# Altium schematic sheet power.SchDoc
size A2; SheetNumber: 5; SheetTotal: 6
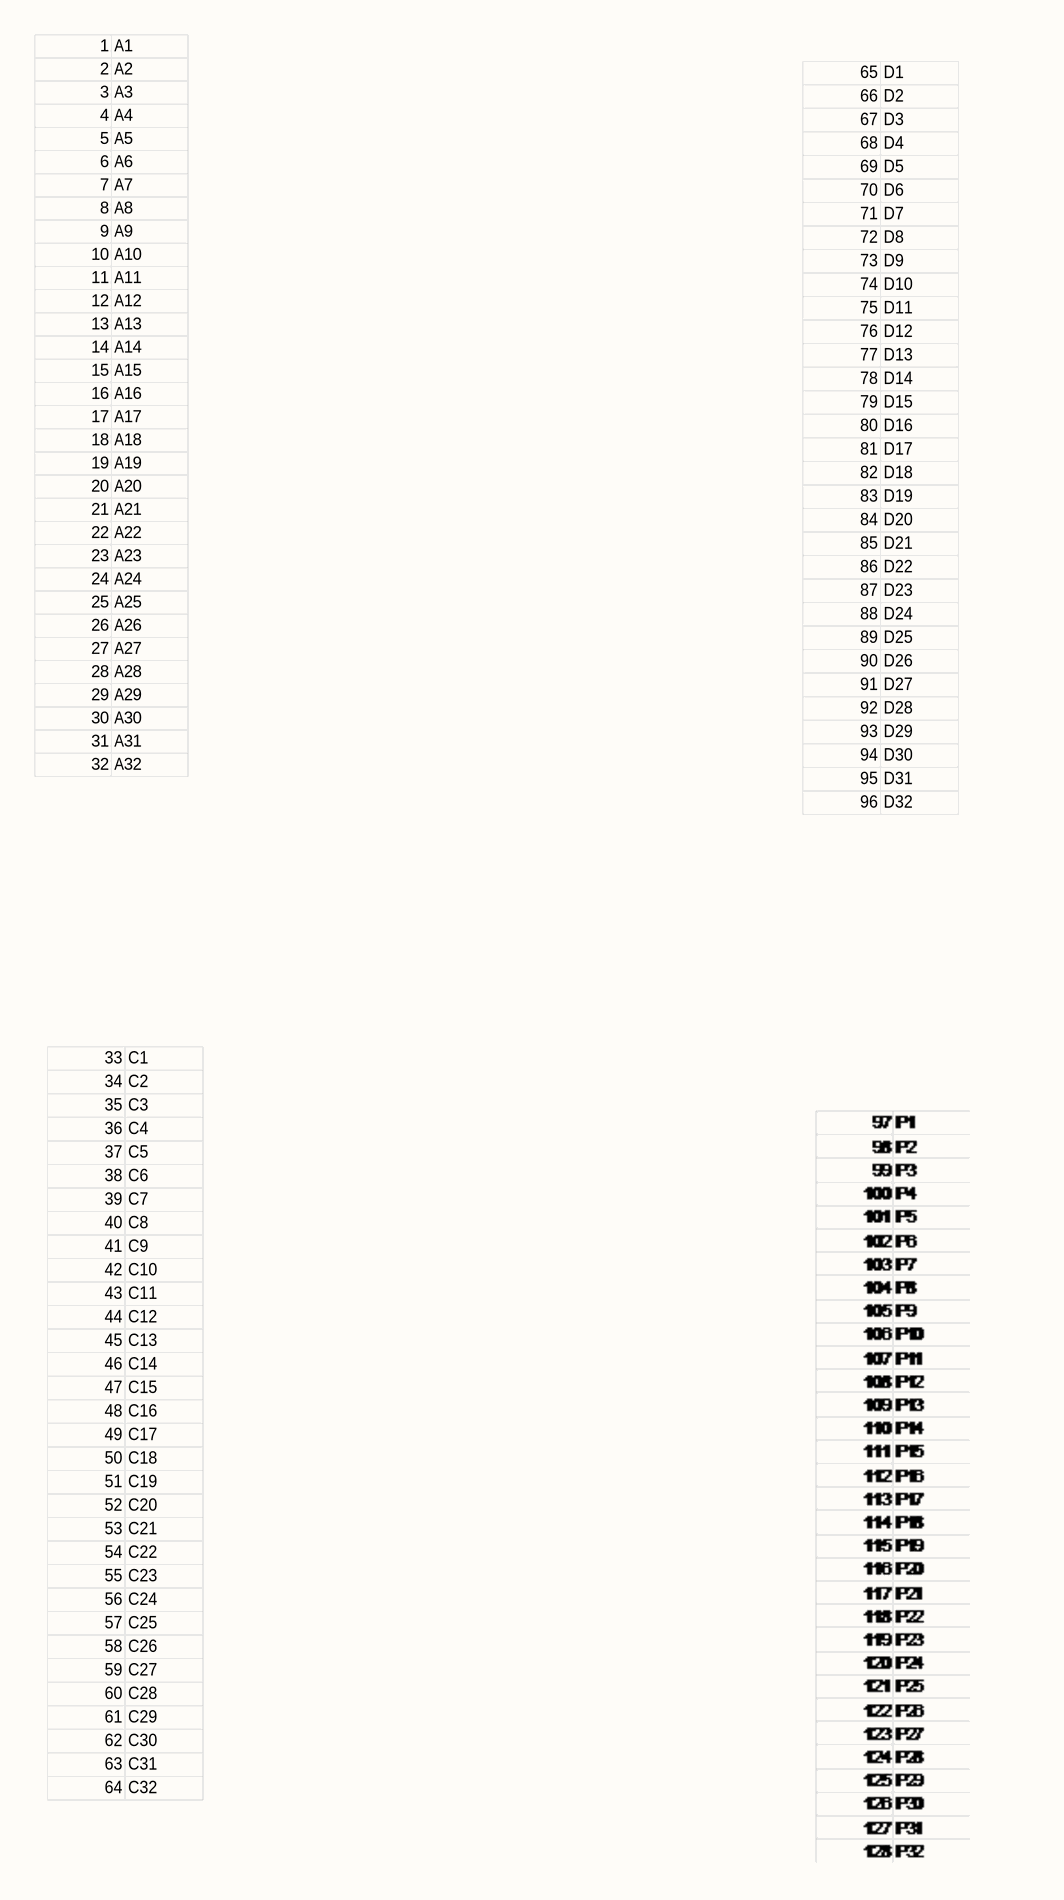
[diagram p0: power.SchDoc, left]
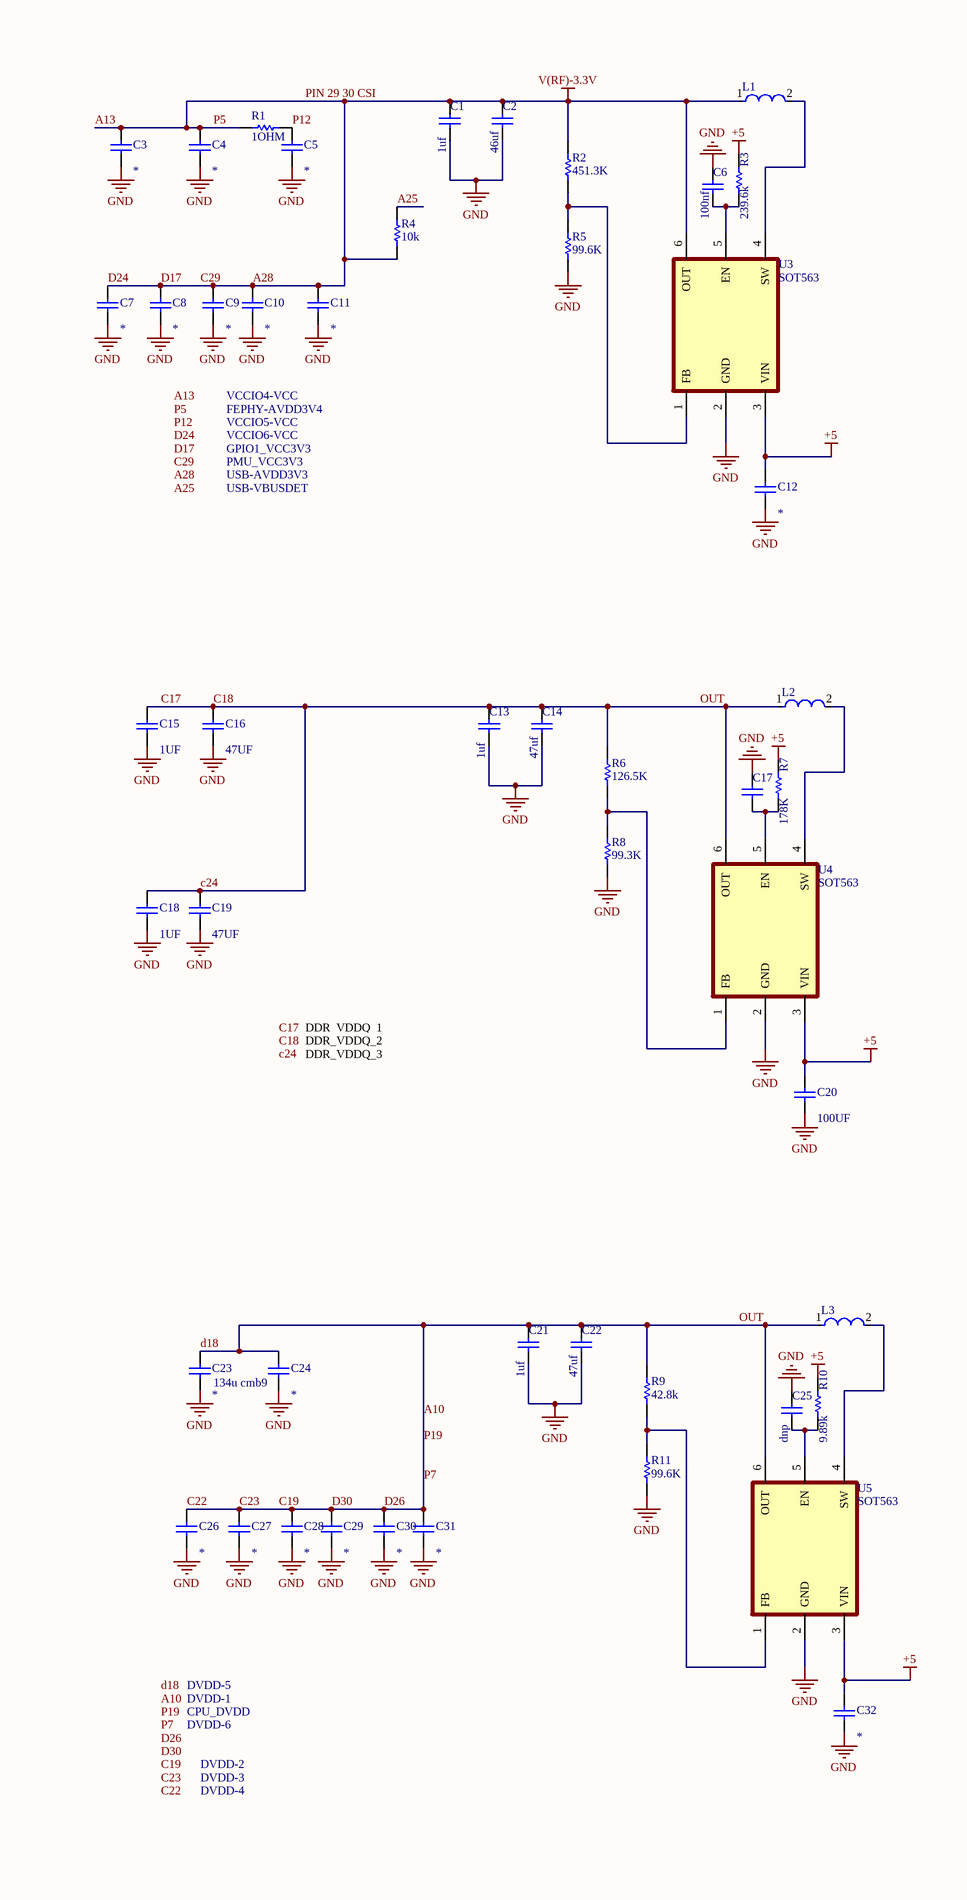
[diagram p1: power.SchDoc, right]

## Parts
C1  1uf  [CAPC1005X56X25LL10T15]
C2  46uf  [CAPC1005X56X25LL10T15]
C3  *  [CAPC1005X56X25LL10T15]
C4  *  [CAPC1005X56X25LL10T15]
C5  *  [CAPC1005X56X25LL10T15]
C6  100nf  [CAPC1005X56X25LL10T15]
C7  *  [CAPC1005X56X25LL10T15]
C8  *  [CAPC1005X56X25LL10T15]
C9  *  [CAPC1005X56X25LL10T15]
C10  *  [CAPC1005X56X25LL10T15]
C11  *  [CAPC1005X56X25LL10T15]
C12  *  [CAPC1005X56X25LL10T15]
C13  1uf  [CAPC1005X56X25LL10T15]
C14  47uf  [CAPC1005X56X25LL10T15]
C15  1UF  [CAPC1005X56X25LL10T15]
C16  47UF  [CAPC1005X56X25LL10T15]
C17  (no value)  [CAPC1005X56X25LL10T15]
C18  1UF  [CAPC1005X56X25LL10T15]
C19  47UF  [CAPC1005X56X25LL10T15]
C20  100UF  [CAPC1005X56X25LL10T15]
C21  1uf  [CAPC1005X56X25LL10T15]
C22  47uf  [CAPC1005X56X25LL10T15]
C23  *  [CAPC1005X56X25LL10T15]
C24  *  [CAPC1005X56X25LL10T15]
C25  dnp  [CAPC1005X56X25LL10T15]
C26  *  [CAPC1005X56X25LL10T15]
C27  *  [CAPC1005X56X25LL10T15]
C28  *  [CAPC1005X56X25LL10T15]
C29  *  [CAPC1005X56X25LL10T15]
C30  *  [CAPC1005X56X25LL10T15]
C31  *  [CAPC1005X56X25LL10T15]
C32  *  [CAPC1005X56X25LL10T15]
L1  (no value)  [FP-LQH31CN_03-MFG]
L2  (no value)  [FP-LQH31CN_03-MFG]
L3  (no value)  [FP-LQH31CN_03-MFG]
R1  1OHM  [RESC1005X40X25LL05T10]
R2  451.3K  [RESC1005X40X25LL05T10]
R3  239.6k  [RESC1005X40X25LL05T10]
R4  10k  [RESC1005X40X25LL05T10]
R5  99.6K  [RESC1005X40X25LL05T10]
R6  126.5K  [RESC1005X40X25LL05T10]
R7  178K  [RESC1005X40X25LL05T10]
R8  99.3K  [RESC1005X40X25LL05T10]
R9  42.8k  [RESC1005X40X25LL05T10]
R10  9.89k  [RESC1005X40X25LL05T10]
R11  99.6K  [RESC1005X40X25LL05T10]
U3  SOT563
U4  SOT563
U5  SOT563

## Nets
+5: C12.2 C20.2 C32.2 R3.2 R7.2 R10.2 U3.3(VIN) U4.3(VIN) U5.3(VIN)
A13: C1.2 C2.2 C3.2 C4.2 C7.2 C8.2 C9.2 C10.2 C11.2 L1.1 R1.2 R2.2 R4.1 U3.6(OUT)  [also labelled A28, C29, D17, D24, P5, PIN 29 30 CSI, V(RF)-3.3V]
GND: C1.1 C2.1 C3.1 C4.1 C5.1 C6.2 C7.1 C8.1 C9.1 C10.1 C11.1 C12.1 C13.1 C14.1 C15.1 C16.1 C17.2 C18.1 C19.1 C20.1 C21.1 C22.1 C23.1 C24.1 C25.2 C26.1 C27.1 C28.1 C29.1 C30.1 C31.1 C32.1 R5.1 R8.1 R11.1 U3.2(GND) U4.2(GND) U5.2(GND)
A10: C13.2 C14.2 C15.2 C16.2 C18.2 C19.2 C21.2 C22.2 C23.2 C24.2 C26.2 C27.2 C28.2 C29.2 C30.2 C31.2 L2.1 L3.1 R6.2 R9.2 U4.6(OUT) U5.6(OUT)  [also labelled C17, C18, C19, C22, C23, c24, d18, D26, D30, OUT, P19, P7]
A25: R4.2
P12: C5.2 R1.1
NetC6_1: C6.1 R3.1 U3.5(EN)
NetC17_1: C17.1 R7.1 U4.5(EN)
NetC25_1: C25.1 R10.1 U5.5(EN)
NetL1_2: L1.2 U3.4(SW)
NetL2_2: L2.2 U4.4(SW)
NetL3_2: L3.2 U5.4(SW)
NetR2_1: R2.1 R5.2 U3.1(FB)
NetR6_1: R6.1 R8.2 U4.1(FB)
NetR9_1: R9.1 R11.2 U5.1(FB)

## Notes on the sheet
- VCCIO4-VCC
- FEPHY-AVDD3V4
- USB-AVDD3V3
- VCCIO5-VCC
- VCCIO6-VCC
- GPIO1_VCC3V3
- PMU_VCC3V3
- USB-VBUSDET
- DDR_VDDQ_1
- DDR_VDDQ_2
- DDR_VDDQ_3
- 134u cmb9
- DVDD-1
- DVDD-5
- CPU_DVDD
- DVDD-6
- DVDD-2
- DVDD-3
- DVDD-4
- Labels drawn without touching a wire or pin: A10, A13, A25, A28, C17, C18, C19, C22, C23, c24, C29, D17, d18, D24, D26, D30, P5, P7, P12, P19

## Library data of the parts
C1-C32 = CMP-2008-02962-1
  C1 C13 C21: VALUE: 1uf
  C2: VALUE: 46uf
  C3-C5 C7-C12 C23 C24 C26-C32: VALUE: *
  C6: VALUE: 100nf
  C14 C22: VALUE: 47uf
  C15 C18: VALUE: 1UF
  C16 C19: VALUE: 47UF
  C20: VALUE: 100UF
  C25: VALUE: dnp
L1-L3 = CMP-06042-002477-1
R1-R11 = CMP-2002-07161-1
  R1: VALUE: 1OHM
  R2: VALUE: 451.3K
  R3: VALUE: 239.6k
  R4: VALUE: 10k
  R5 R11: VALUE: 99.6K
  R6: VALUE: 126.5K
  R7: VALUE: 178K
  R8: VALUE: 99.3K
  R9: VALUE: 42.8k
  R10: VALUE: 9.89k